# Altium schematic sheet Power.SchDoc
size A4; SheetNumber: 3; SheetTotal: 5
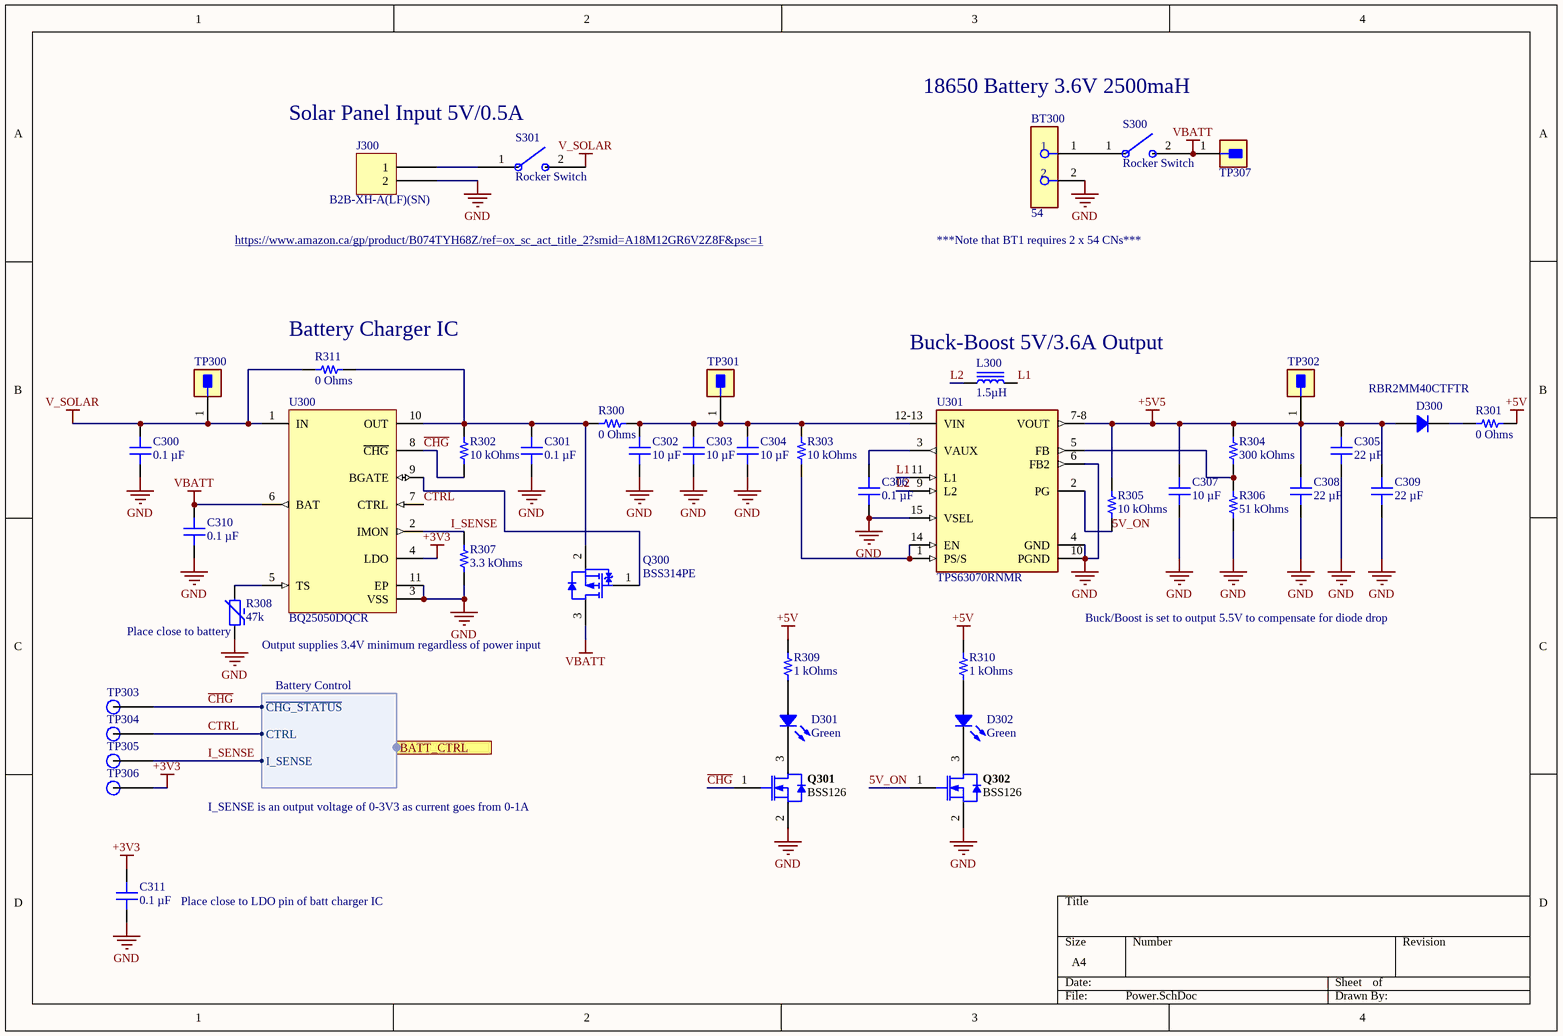
[diagram p0: Power.SchDoc]

## Parts
BT300  54  [FP-54-MFG]
C300  0.1 µF  [CAP 0603_1608]
C301  0.1 µF  [CAP 0603_1608]
C302  10 µF  [CAP 0603_1608]
C303  10 µF  [CAP 0603_1608]
C304  10 µF  [CAP 0603_1608]
C305  22 µF  [CAP 0805_2012]
C306  0.1 µF  [CAP 0603_1608]
C307  10 µF  [CAP 0603_1608]
C308  22 µF  [CAP 0805_2012]
C309  22 µF  [CAP 0805_2012]
C310  0.1 µF  [CAP 0603_1608]
C311  0.1 µF  [CAP 0603_1608]
D300  RBR2MM40CTFTR  [SOD123F]
D301  Green  [LED 0603_1608 GREEN]
D302  Green  [LED 0603_1608 GREEN]
J300  B2B-XH-A(LF)(SN)  [JST XH B2B-XH-A]
L300  1.5µH  [IND 1008_2520]
Q300  BSS314PE  [INF-PG-SOT23_N]
Q301  BSS126  [INF-PG-SOT23_L]
Q302  BSS126  [INF-PG-SOT23_L]
R300  0 Ohms  [RES 0603_1608]
R301  0 Ohms  [RES 0603_1608]
R302  10 kOhms  [RES 0603_1608]
R303  10 kOhms  [RES 0603_1608]
R304  300 kOhms  [RES 0603_1608]
R305  10 kOhms  [RES 0603_1608]
R306  51 kOhms  [RES 0603_1608]
R307  3.3 kOhms  [RES 0603_1608]
R308  47k  [NTC 0603_1608]
R309  1 kOhms  [RES 0603_1608]
R310  1 kOhms  [RES 0603_1608]
R311  0 Ohms  [RES 0603_1608]
S300  Rocker Switch  [Rocker Switch-Footprint-1]
S301  Rocker Switch  [Rocker Switch-Footprint-1]
TP300  S2751-46R  [FP-S2751-46R-MFG]  (value not drawn)
TP301  S2751-46R  [FP-S2751-46R-MFG]  (value not drawn)
TP302  S2751-46R  [FP-S2751-46R-MFG]  (value not drawn)
TP303  1.5mm Test Point  [1mm Test Point-Footprint-1]  (value not drawn)
TP304  1.5mm Test Point  [1mm Test Point-Footprint-1]  (value not drawn)
TP305  1.5mm Test Point  [1mm Test Point-Footprint-1]  (value not drawn)
TP306  1.5mm Test Point  [1mm Test Point-Footprint-1]  (value not drawn)
TP307  S2751-46R  [FP-S2751-46R-MFG]  (value not drawn)
U300  BQ25050DQCR  [DQC0010A]
U301  TPS63070RNMR  [FP-RNM0015A-MFG]

## Ports
BATT_CTRL (out, harness Battery Control)

## Harnesses
Battery Control: ~{CHG_STATUS}, CTRL, I_SENSE

## Nets
+3V3: C311.2 TP306.1 U300.4(LDO)
+5V: R301.2 R309.2 R310.2
+5V5: C305.2 C307.2 C308.2 C309.2 D300.1 R304.2 R305.2 TP302.1 U301.7-8(VOUT)
GND: BT300.2 C300.1 C301.1 C302.1 C303.1 C304.1 C305.1 C306.1 C307.1 C308.1 C309.1 C310.1 C311.1 J300.2 Q301.2(SOURCE) Q302.2(SOURCE) R306.1 R307.1 R308.1 U300.3(VSS) U300.11(EP) U301.4(GND) U301.6(FB2) U301.10(PGND) U301.15(VSEL)
V_SOLAR: C300.2 R311.1 S301.2 TP300.1 U300.1(IN)
VBATT: C310.2 Q300.3(DRAIN) S300.2 TP307.1 U300.6(BAT)
5V_ON: Q302.1(GATE) R305.1 U301.2(PG)
~{CHG}: Q301.1(GATE) R302.1 TP303.1 U300.8(~{CHG}) ; port BATT_CTRL.~{CHG_STATUS}
CTRL: TP304.1 U300.7(CTRL) ; port BATT_CTRL.CTRL
I_SENSE: R307.2 TP305.1 U300.2(IMON) ; port BATT_CTRL.I_SENSE
L1: L300.2 U301.11(L1)
L2: L300.1 U301.9(L2)
NetBT300_1: BT300.1 S300.1
NetC301_2: C301.2 Q300.2(SOURCE) R300.1 R302.2 R311.2 U300.10(OUT)
NetC302_2: C302.2 C303.2 C304.2 R300.2 R303.2 TP301.1 U301.12-13(VIN)
NetC306_2: C306.2 U301.3(VAUX)
NetD300_2: D300.2 R301.1
NetD301_1: D301.1 R309.1
NetD301_2: D301.2 Q301.3(DRAIN)
NetD302_1: D302.1 R310.1
NetD302_2: D302.2 Q302.3(DRAIN)
NetJ300_1: J300.1 S301.1
NetQ300_1: Q300.1(GATE) U300.9(BGATE)
NetR303_1: R303.1 U301.1(PS/S) U301.14(EN)
NetR304_1: R304.1 R306.2 U301.5(FB)
NetR308_2: R308.2 U300.5(TS)

## Notes on the sheet
- 18650 Battery 3.6V 2500maH
- Solar Panel Input 5V/0.5A
- https://www.amazon.ca/gp/product/B074TYH68Z/ref=ox_sc_act_title_2?smid=A18M12GR6V2Z8F&psc=1
- ***Note that BT1 requires 2 x 54 CNs***
- (near R311) Battery Charger IC
- (near L300) Buck-Boost 5V/3.6A Output
- (near R308) Place close to battery
- Output supplies 3.4V minimum regardless of power input
- Buck/Boost is set to output 5.5V to compensate for diode drop
- I_SENSE is an output voltage of 0-3V3 as current goes from 0-1A
- Place close to LDO pin of batt charger IC

## Library data of the parts
BT300 = CMP-00051-1: Cylindrical Battery Contacts, Clips, Holders & Springs 16-19mm PC BATTERY CLIP; Lead Free: Lead Free
C300 C301 C306 C310 C311 = C0603C104K5RAC7411: CAP CER 0.1UF 50V X7R 0603; manufacturer: KEMET; Tolerance: ±10%; Part Number: C0603C104K5RAC7411; Value: 0.1 µF; Applications: Bypass, Decoupling; Capacitance: 0.1 µF; componentlink1description: Datasheet; componentlink1url: https://api.kemet.com/component-edge/download/datasheet/C0603C104K5RAC7411.pdf; componentlink2description: DigiKey Link; componentlink2url: https://www.digikey.com/en/products/detail/kemet/C0603C104K5RAC7411/3317013; Device Package: 0603 (1608 Metric); lastupdated: 2022-09-19 1:01:20 PM; Lifecycle Status: Active; Minimum Order: 15000; Mounting Type: Surface Mount, MLCC; Operating Temperature: -55°C ~ 125°C; Package / Case: 0603 (1608 Metric); packaging: TapeAndReel; partid: 2233; Part Status: Active; price: 0.01; series: SMD Comm X7R; Size / Dimension: 0.063" L x 0.031" W (1.60mm x 0.80mm); Supplier 1: DigiKey; Supplier Part Number 1: 399-7374-2-ND; Temperature Coefficient: X7R; Thickness (Max): 0.035" (0.90mm); Voltage - Rated: 50V
C302-C304 C307 = GRM188R61E106MA73J: CAP CER 10UF 25V X5R 0603; manufacturer: Murata Electronics; Tolerance: ±20%; Part Number: GRM188R61E106MA73J; Value: 10 µF; Applications: General Purpose; Capacitance: 10 µF; componentlink1description: Datasheet; componentlink1url: https://search.murata.co.jp/Ceramy/image/img/A01X/G101/ENG/GRM188R61E106MA73-01.pdf; componentlink2description: DigiKey Link; componentlink2url: https://www.digikey.com/en/products/detail/murata-electronics/GRM188R61E106MA73J/4905347; Device Package: 0603 (1608 Metric); lastupdated: 2022-09-19 1:00:57 PM; Lifecycle Status: Active; Minimum Order: 1; Mounting Type: Surface Mount, MLCC; Operating Temperature: -55°C ~ 85°C; Package / Case: 0603 (1608 Metric); packaging: TapeAndReel; partid: 10710; Part Status: Active; price: 0.05; series: GRM; Size / Dimension: 0.063" L x 0.031" W (1.60mm x 0.80mm); Supplier 1: DigiKey; Supplier Part Number 1: 490-12737-1-ND; Temperature Coefficient: X5R; Thickness (Max): 0.039" (1.00mm); Voltage - Rated: 25V
C305 C308 C309 = CL21A226MOQNNNE: CAP CER 22UF 16V X5R 0805; manufacturer: Samsung Electro-Mechanics; Tolerance: ±20%; Part Number: CL21A226MOQNNNE; Value: 22 µF; Applications: General Purpose; Capacitance: 22 µF; componentlink1description: Datasheet; componentlink1url: http://www.samsungsem.com/kr/support/product-search/mlcc/CL21A226MOQNNNE.jsp; componentlink2description: DigiKey Link; componentlink2url: https://www.digikey.com/en/products/detail/samsung-electro-mechanics/CL21A226MOQNNNE/3888567; Device Package: 0805 (2012 Metric); lastupdated: 2022-09-19 1:04:25 PM; Lifecycle Status: Active; Minimum Order: 1; Mounting Type: Surface Mount, MLCC; Operating Temperature: -55°C ~ 85°C; Package / Case: 0805 (2012 Metric); packaging: TapeAndReel; partid: 3052; Part Status: Active; price: 0.05; series: CL; Size / Dimension: 0.079" L x 0.049" W (2.00mm x 1.25mm); Supplier 1: DigiKey; Supplier Part Number 1: 1276-2909-1-ND; Temperature Coefficient: X5R; Thickness (Max): 0.055" (1.40mm); Voltage - Rated: 16V
D300 = RBR2MM40CTFTR: DIODE (RECTIFIER FRD) 40V-VR 2A-; Manufacturer: Rohm Semiconductor; Current - Average Rectified (Io): 2A; Current - Reverse Leakage @ Vr: 100 µA @ 40 V; Diode Type: Schottky; Speed: Fast Recovery =< 500ns, > 200mA (Io); Voltage - DC Reverse (Vr) (Max): 40 V; Voltage - Forward (Vf) (Max) @ If: 520 mV @ 2 A; Part Number: RBR2MM40CTFTR; ComponentLink1Description: Datasheet; ComponentLink1URL: https://www.rohm.com/datasheet/RBR2MM40CTF/rbr2mm40ctftr-e; ComponentLink2Description: DigiKey Link; ComponentLink2URL: https://www.digikey.com/en/products/detail/rohm-semiconductor/RBR2MM40CTFTR/9748140; LastUpdated: 2022-09-19 1:46:35 PM; Lifecycle Status: Active; Minimum Order: 1; Mounting Type: Surface Mount; Operating Temperature - Junction: 150°C (Max); Package / Case: SOD-123F; Packaging: TapeAndReel; PartId: 2367; Part Status: Active; Price: 0.12; Series: Automotive, AEC-Q101; Supplier 1: DigiKey; Supplier Part Number 1: RBR2MM40CTFCT-ND; Supplier Device Package: PMDU
D301 D302 = XZVGT53W-6: LED GREEN CLEAR 2SMD; Manufacturer: SunLED; Configuration: Standard; Current - Test: 20mA; Lens Color: Colorless; Lens Size: 1.20mm x 0.80mm; Lens Style: Rectangle with Flat Top; Millicandela Rating: 49mcd; Viewing Angle: 120°; Voltage - Forward (Vf) (Typ): 2.1V; Wavelength - Dominant: 570nm; Wavelength - Peak: 574nm; Part Number: XZVGT53W-6; Color: Green; ComponentLink1Description: Datasheet; ComponentLink1URL: https://www.sunledusa.com/products/spec/XZVGT53W-6.pdf; ComponentLink2Description: DigiKey Link; ComponentLink2URL: https://www.digikey.com/en/products/detail/sunled/XZVGT53W-6/4902128; Device Package: 0603 (1608 Metric); Height (Max): 0.28mm; LastUpdated: 2022-09-13 7:29:38 AM; Lens Transparency: Clear; Lifecycle Status: Active; Minimum Order: 1; Mounting Type: Surface Mount; Package / Case: 0603 (1608 Metric); Packaging: TapeAndReel; PartId: 581; Part Status: Active; Price: 0.05; Series: -; Size / Dimension: 1.60mm L x 0.80mm W; Supplier 1: DigiKey; Supplier Part Number 1: 1497-1243-1-ND; Supplier Device Package: 2-SMD; Value: Green
J300 = B2B-XH-A(LF)(SN): CONN HEADER VERT 2POS 2.5MM; Manufacturer: JST Sales America Inc.; Contact Length - Post: 0.134" (3.40mm); Current Rating (Amps): 3A; Material Flammability Rating: UL94 V-0; Number of Positions: 2; Number of Positions Loaded: All; Pitch - Mating: 0.098" (2.50mm); Shrouding: Shrouded - 4 Wall; Style: Board to Cable/Wire; Voltage Rating: 250V; Part Number: B2B-XH-A(LF)(SN); ComponentLink1Description: Datasheet; ComponentLink1URL: http://www.jst-mfg.com/product/pdf/eng/eXH.pdf; ComponentLink2Description: DigiKey Link; ComponentLink2URL: http://digikey.com/product-detail/en/jst-sales-america-inc/B2B-XH-A-LF-SN/455-2247-ND/1651045; Connector Type: Header; Contact Finish - Mating: Tin; Contact Finish - Post: Tin; Contact Material: Brass; Contact Shape: Square; Contact Type: Male Pin; Fastening Type: Detent Lock; Insulation Color: Natural; Insulation Height: 0.276" (7.00mm); Insulation Material: Polyamide (PA66), Nylon 6/6; LastUpdated: 2020-01-12 11:46:08 PM; Lifecycle Status: Active; Minimum Order: 1; Mounting Type: Through Hole; Number of Rows: 1; Operating Temperature: -25°C ~ 85°C; Packaging: Bulk; PartId: 67; Part Status: Active; Price: 0.15; Series: XH; Supplier 1: DigiKey; Supplier Part Number 1: 455-2247-ND; Termination: Press-Fit, Solder
L300 = CVH252009-1R5M: FIXED IND 1.5UH 1.5A 70 MOHM SMD; Manufacturer: Bourns Inc.; DC Resistance (DCR): 70mOhm Max; Frequency - Self Resonant: 50MHz; Inductance Frequency - Test: 1MHz; Material - Core: Ferrite; Shielding: Shielded; Tolerance: ±20%; Type: Multilayer; Part Number: CVH252009-1R5M; ComponentLink1Description: Datasheet; ComponentLink1URL: https://www.bourns.com/docs/Product-Datasheets/CVH.pdf; ComponentLink2Description: DigiKey Link; ComponentLink2URL: http://digikey.com/product-detail/en/bourns-inc/CVH252009-1R5M/CVH252009-1R5MCT-ND/3440084; Current Rating (Amps): 1.5A; Device Package: 1008 (2520 Metric); Height - Seated (Max): 0.039" (1.00mm); Inductance: 1.5µH; LastUpdated: 2020-09-02 1:28:58 AM; Lifecycle Status: Active; Minimum Order: 1; Mounting Type: Surface Mount; Operating Temperature: -55°C ~ 125°C; Package / Case: 1008 (2520 Metric); Packaging: TapeAndReel; PartId: 3416; Part Status: Active; Price: 0.10; Series: CVH252009; Size / Dimension: 0.098" L x 0.079" W (2.50mm x 2.00mm); Supplier 1: DigiKey; Supplier Part Number 1: CVH252009-1R5MCT-ND; Supplier Device Package: 1008 (2520 Metric); Value: 1.5µH
Q300 = CMP-1099-00027-1: P-Channel OptiMOS P3 Small-Signal-Transistor, -30 V VDS, -1.5 A ID, -55 to 150 degC, PG-SOT23, Reel, Green; Manufacturer: Infineon; Rth: 250Â K/W; RDS (on) (max): 140Â mOhm; QG: -2.9Â nC; IDpuls (max): -6.1Â A; RDS (on) (max) (@4.5V): 230Â mOhm; Pto t (max): 0.5Â W; Green: TRUE; VDS (max): -30Â V; VGS(th) (max): -2Â V; VGS(th) (min): -1Â V; ID (max): -1.5Â A; ComponentLink2URL: http://www.infineon.com/dgdl/BSS314PE_rev2.3.pdf?folderId=db3a304314dca38901154a72e3951a65&fileId=db3a304330f68606013109b696aa0084; ComponentLink3Description: Package Specification; ComponentLink1URL: http://www.infineon.com/; ComponentLink1Description: Manufacturer URL; Mounting Technology: Surface Mount; PartNumber: BSS314PE; PackageReference: PG-SOT23; PackageVersion: Apr-08; Halogen-free: TRUE; ComponentLink3URL: http://www.infineon.com/dgdl/SOT23-Package_Overview.pdf?folderId=db3a30431936bc4b0119532290053c66&fileId=db3a30431936bc4b0119533468123c85; PackageDescription: 3-Pin Small Outline Transistor Package, 2.9 x 1.3 mm Body, 0.95 mm Pitch; ComponentLink2Description: Datasheet; DatasheetVersion: Rev. 2.3; Packing: Reel
Q301 Q302 = CMP-1153-00007-1: N-Channel SIPMOS Small-Signal-Transistor, 600 V VDS, 0.021 A ID, -55 to 150 degC, PG-SOT23, Reel, Green; Manufacturer: Infineon; VGS(th)(min): -2.7Â V; RDS (on)(max): 700 mOhm; VGS(th)(max): -1.6Â V; Green: TRUE; RthJC(max): 350 K/W; IDpuls(max): 0.085Â A; Ptot(max): 0.5 W; QG: 1.4Â nC; VDS (max): 600 V; ID(max): 0.021Â A; Mode: Depletion; PackageDescription: 3-Pin Small Outline Transistor Package, 2.9 x 1.3 mm Body, 0.95 mm Pitch; ComponentLink3URL: http://www.infineon.com/dgdl/SOT23-Package_Overview.pdf?folderId=db3a30431936bc4b0119532290053c66&fileId=db3a30431936bc4b0119533468123c85; PackageReference: PG-SOT23; PackageVersion: Apr-08; Halogen-free: TRUE; DatasheetVersion: Rev. 2.1; ComponentLink1Description: Manufacturer URL; ComponentLink2URL: http://www.infineon.com/dgdl/BSS126_Rev2.1.pdf?folderId=db3a3043156fd573011622e10b5c1f67&fileId=db3a304330f6860601310483af163eba; Packing: Reel; ComponentLink3Description: Package Specification; ComponentLink2Description: Datasheet; ComponentLink1URL: http://www.infineon.com/; PartNumber: BSS126; Mounting Technology: Surface Mount; Technology: SIPMOS
R300 R301 R311 = PA0603-R-070RL: RES 0 OHM JUMPER 1/10W 0603; Manufacturer: Yageo; Power (Watts): 0.1W, 1/10W; Temperature Coefficient: ±150ppm/°C; Part Number: PA0603-R-070RL; Value: 0 Ohms; ComponentLink1Description: Datasheet; ComponentLink1URL: http://www.yageo.com/NewPortal/_en/search/productDocs.jsp?YageoPartNumber=PA0603-R-070RL; ComponentLink2Description: DigiKey Link; ComponentLink2URL: https://www.digikey.com/en/products/detail/yageo/PA0603-R-070RL/8255972; Composition: Metal Element; Device Package: 0603 (1608 Metric); Features: Automotive AEC-Q200, Current Sense; Height - Seated (Max): 0.024" (0.60mm); LastUpdated: 2022-09-19 1:22:34 PM; Lifecycle Status: Active; Minimum Order: 1; Number of Terminations: 2; Operating Temperature: -55°C ~ 155°C; Package / Case: 0603 (1608 Metric); Packaging: TapeAndReel; PartId: 4862; Part Status: Active; Price: 0.08; Resistance: 0 Ohms; Series: PA; Size / Dimension: 0.063" L x 0.031" W (1.60mm x 0.80mm); Supplier 1: DigiKey; Supplier Part Number 1: YAG5757CT-ND; Supplier Device Package: 0603; Tolerance: Jumper
R302 R303 R305 = RT0603FRE0710KL: RES SMD 10K OHM 1% 1/10W 0603; Manufacturer: Yageo; Power (Watts): 0.1W, 1/10W; Temperature Coefficient: ±50ppm/°C; Part Number: RT0603FRE0710KL; Value: 10 kOhms; ComponentLink1Description: Datasheet; ComponentLink1URL: https://www.yageo.com/upload/media/product/productsearch/datasheet/rchip/PYu-RT_1-to-0.01_RoHS_L_11.pdf; ComponentLink2Description: DigiKey Link; ComponentLink2URL: https://www.digikey.com/en/products/detail/yageo/RT0603FRE0710KL/1075040; Composition: Thin Film; Device Package: 0603 (1608 Metric); Height - Seated (Max): 0.022" (0.55mm); LastUpdated: 2022-09-19 1:22:31 PM; Lifecycle Status: Active; Minimum Order: 1; Number of Terminations: 2; Operating Temperature: -55°C ~ 155°C; Package / Case: 0603 (1608 Metric); Packaging: TapeAndReel; PartId: 5671; Part Status: Active; Price: 0.01; Resistance: 10 kOhms; Series: RT; Size / Dimension: 0.063" L x 0.031" W (1.60mm x 0.80mm); Supplier 1: DigiKey; Supplier Part Number 1: YAG2321CT-ND; Supplier Device Package: 0603; Tolerance: ±1%
R304 = RC0603FR-07300KL: RES 300K OHM 1% 1/10W 0603; Manufacturer: Yageo; Power (Watts): 0.1W, 1/10W; Temperature Coefficient: ±100ppm/°C; Part Number: RC0603FR-07300KL; Value: 300 kOhms; ComponentLink1Description: Datasheet; ComponentLink1URL: https://www.yageo.com/upload/media/product/productsearch/datasheet/rchip/PYu-RC_Group_51_RoHS_L_10.pdf; ComponentLink2Description: DigiKey Link; ComponentLink2URL: https://www.digikey.com/en/products/detail/yageo/RC0603FR-07300KL/727145; Composition: Thick Film; Device Package: 0603 (1608 Metric); Features: Moisture Resistant; Height - Seated (Max): 0.022" (0.55mm); LastUpdated: 2022-09-19 1:22:24 PM; Lifecycle Status: Active; Minimum Order: 1; Number of Terminations: 2; Operating Temperature: -55°C ~ 155°C; Package / Case: 0603 (1608 Metric); Packaging: CutTape; PartId: 7517; Part Status: Active; Price: 0.01; Resistance: 300 kOhms; Series: RC_L; Size / Dimension: 0.063" L x 0.031" W (1.60mm x 0.80mm); Supplier 1: DigiKey; Supplier Part Number 1: 311-300KHRCT-ND; Supplier Device Package: 0603; Tolerance: ±1%
R306 = CRCW060351K0FKEA: RES SMD 51K OHM 1% 1/10W 0603; Manufacturer: Vishay Dale; Power (Watts): 0.1W, 1/10W; Temperature Coefficient: ±100ppm/°C; Part Number: CRCW060351K0FKEA; Value: 51 kOhms; ComponentLink1Description: Datasheet; ComponentLink1URL: http://www.vishay.com/docs/20035/dcrcwe3.pdf; ComponentLink2Description: DigiKey Link; ComponentLink2URL: http://digikey.com/product-detail/en/vishay-dale/CRCW060351K0FKEA/541-51.0KHCT-ND/1180004; Composition: Thick Film; Device Package: 0603 (1608 Metric); Features: Automotive AEC-Q200; Height - Seated (Max): 0.020" (0.50mm); LastUpdated: 2022-09-19 1:22:23 PM; Lifecycle Status: Active; Minimum Order: 1; Number of Terminations: 2; Operating Temperature: -55°C ~ 155°C; Package / Case: 0603 (1608 Metric); Packaging: CutTape; PartId: 7831; Part Status: Active; Price: 0.10; Ratings: AEC-Q200; Resistance: 51 kOhms; Series: CRCW; Size / Dimension: 0.061" L x 0.033" W (1.55mm x 0.85mm); Supplier 1: DigiKey; Supplier Part Number 1: 541-51.0KHCT-ND; Supplier Device Package: 0603; Tolerance: ±1%
R307 = CRGP0603F3K3: RES 3.3K OHM 1% 1/4W 0603; Manufacturer: TE Connectivity Passive Product; Power (Watts): 0.25W, 1/4W; Temperature Coefficient: ±100ppm/°C; Part Number: CRGP0603F3K3; Value: 3.3 kOhms; ComponentLink1Description: Datasheet; ComponentLink1URL: https://www.te.com/commerce/DocumentDelivery/DDEController?Action=srchrtrv&DocNm=9-1773463-9&DocType=DS&DocLang=English; ComponentLink2Description: DigiKey Link; ComponentLink2URL: https://www.digikey.com/en/products/detail/te-connectivity-passive-product/CRGP0603F3K3/8577024; Composition: Thick Film; Device Package: 0603 (1608 Metric); Features: Pulse Withstanding; Height - Seated (Max): 0.022" (0.55mm); LastUpdated: 2022-09-19 1:22:34 PM; Lifecycle Status: Active; Minimum Order: 1; Number of Terminations: 2; Operating Temperature: -55°C ~ 155°C; Package / Case: 0603 (1608 Metric); Packaging: TapeAndReel; PartId: 5037; Part Status: Active; Price: 0.02; Resistance: 3.3 kOhms; Series: CRGP; Size / Dimension: 0.063" L x 0.031" W (1.60mm x 0.80mm); Supplier 1: DigiKey; Supplier Part Number 1: A130422CT-ND; Supplier Device Package: 0603; Tolerance: ±1%
R308 = NCP18WB473F10RB: THERMISTOR NTC 47KOHM 4050K 0603; Manufacturer: Murata Electronics; B25/100: 4131K; B25/85: 4108K; B Value Tolerance: ±1.5%; Power - Max: 100mW; Resistance Tolerance: ±1%; Part Number: NCP18WB473F10RB; B25/50: 4050K; ComponentLink1Description: Datasheet; ComponentLink1URL: https://www.murata.com/~/media/webrenewal/support/library/catalog/products/thermistor/ntc/r44e.ashx?la=en-us; ComponentLink2Description: DigiKey Link; ComponentLink2URL: http://digikey.com/product-detail/en/murata-electronics/NCP18WB473F10RB/490-6942-2-ND/2595099; Device Package: 0603 (1608 Metric); LastUpdated: 2022-09-19 1:53:39 PM; Lifecycle Status: Active; Minimum Order: 0; Mounting Type: Surface Mount; Operating Temperature: -40°C ~ 125°C; Package / Case: 0603 (1608 Metric); Packaging: TapeAndReel; PartId: 378; Part Status: Active; Price: 0.20; Resistance in Ohms @ 25°C: 47k; Series: NCP18; Supplier 1: DigiKey; Supplier Part Number 1: 490-6942-2-ND; Value: 47k
R309 R310 = RT0603FRE071KL: RES SMD 1K OHM 1% 1/10W 0603; Manufacturer: Yageo; Power (Watts): 0.1W, 1/10W; Temperature Coefficient: ±50ppm/°C; Part Number: RT0603FRE071KL; Value: 1 kOhms; ComponentLink1Description: Datasheet; ComponentLink1URL: https://www.yageo.com/upload/media/product/productsearch/datasheet/rchip/PYu-RT_1-to-0.01_RoHS_L_11.pdf; ComponentLink2Description: DigiKey Link; ComponentLink2URL: https://www.digikey.com/en/products/detail/yageo/RT0603FRE071KL/1075188; Composition: Thin Film; Device Package: 0603 (1608 Metric); Height - Seated (Max): 0.022" (0.55mm); LastUpdated: 2022-09-14 8:09:45 AM; Lifecycle Status: Active; Minimum Order: 1; Number of Terminations: 2; Operating Temperature: -55°C ~ 155°C; Package / Case: 0603 (1608 Metric); Packaging: TapeAndReel; PartId: 5672; Part Status: Active; Price: 0.01; Resistance: 1 kOhms; Series: RT; Size / Dimension: 0.063" L x 0.031" W (1.60mm x 0.80mm); Supplier 1: DigiKey; Supplier Part Number 1: YAG2323CT-ND; Supplier Device Package: 0603; Tolerance: ±1%
S300 S301 = CMP-00054-3: 12mm x 18.5mm Rocker Switch 6A 250VAC
TP300-TP302 TP307 = CMP-00053-4: Conn Test Point 1 POS Solder ST SMD 1 Port T/R; Body Material: Brass; Plating: Tin; Packaging: Cut Tape; Series: S2751, EZ BoardWare; Material: Copper Alloy; Color: Natural; Mount: Surface Mount
TP303-TP306 = CMP-002-00006-1: 1.5mm Test Point 0.75mm hole size
U300 = CMP-0321-00476-2: 1 A, Single-Input, Single Cell Li-Ion Battery Charger with 50 mA LDO, -40 to 85 degC, 10-pin WSON (DQC), Green (RoHS & no Sb/Br); Manufacturer: Texas Instruments; Li-Polymer: N; SubFamily: Battery Charge Management; PartNumber: BQ25050DQCR; ComponentLink1URL: http://www.ti.com/general/docs/lit/getliterature.tsp?genericPartNumber=BQ25050&fileType=pdf; DatasheetVersion: SLUSA33; Li-Ion: N; NiCd: N; Lead Acid: N; NiMH: N; Eco-Plan: Green (RoHS & no Sb/Br); ComponentLink1Description: Datasheet; Over Voltage Protection: N; Mounting Technology: Surface Mount; PackageDescription: 10-Pin Plastic Small Outline No-Lead, 2 x 3 x 0.8 mm Body, 0.5 mm Pitch, Exposed Pad; PackageReference: DQC0010A; PackageVersion: revA, Jul-2008
U301 = CMP-04918-000409-1: IC REG BCK BST ADJ 3.6A 15VQFN; Synchronous Rectifier: Yes; Output Type: Adjustable; Output Current: 2A; Max Input Voltage: 16V; Switching Frequency: 2.4MHz; Min Output Voltage: 2.5V; Output Configuration: Positive; Min Input Voltage: 2V; Topology: Buck-Boost; Number of Outputs: 1; Max Output Voltage: 9V; Quiescent Current: 50uA; Max Operating Temperature: 125°C; Case/Package: VQFN; Number of Pins: 15; RoHS Compliant: Yes; Mount: Surface Mount; Min Operating Temperature: -40°C; Lead Free: Lead Free; Packaging: Tape and Reel